# Altium schematic sheet DC Link.SchDoc
size A; SheetNumber: 6; SheetTotal: 7
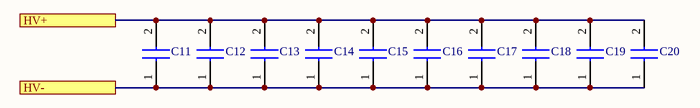
[diagram p0: DC Link.SchDoc]

## Parts
C11  B58031U9254M062  [B58031U9254M062]  (value not drawn)
C12  B58031U9254M062  [B58031U9254M062]  (value not drawn)
C13  B58031U9254M062  [B58031U9254M062]  (value not drawn)
C14  B58031U9254M062  [B58031U9254M062]  (value not drawn)
C15  B58031U9254M062  [B58031U9254M062]  (value not drawn)
C16  B58031U9254M062  [B58031U9254M062]  (value not drawn)
C17  B58031U9254M062  [B58031U9254M062]  (value not drawn)
C18  B58031U9254M062  [B58031U9254M062]  (value not drawn)
C19  B58031U9254M062  [B58031U9254M062]  (value not drawn)
C20  B58031U9254M062  [B58031U9254M062]  (value not drawn)

## Ports
HV+, HV-

## Nets
HV+: C11.2 C12.2 C13.2 C14.2 C15.2 C16.2 C17.2 C18.2 C19.2 C20.2 ; port HV+
HV-: C11.1 C12.1 C13.1 C14.1 C15.1 C16.1 C17.1 C18.1 C19.1 C20.1 ; port HV-

## Library data of the parts
C11-C20 = B58031U9254M062: Capacitor; Manufacturer_Name: TDK; Datasheet Link: https://product.tdk.com/system/files/dam/doc/product/capacitor/ceramic/ceralink/data_sheet/20/10/ds/b58031_lp.pdf; Height: 4.5mm; Manufacturer_Part_Number: B58031U9254M062; Mouser Part Number: 871-B58031U9254M062; Mouser Price/Stock: https://www.mouser.co.uk/ProductDetail/EPCOS-TDK/B58031U9254M062?qs=Mv7BduZupUir5egwM6Ifng%3D%3D; Arrow Part Number: B58031U9254M062; Arrow Price/Stock: https://www.arrow.com/en/products/b58031u9254m062/tdk?region=europe